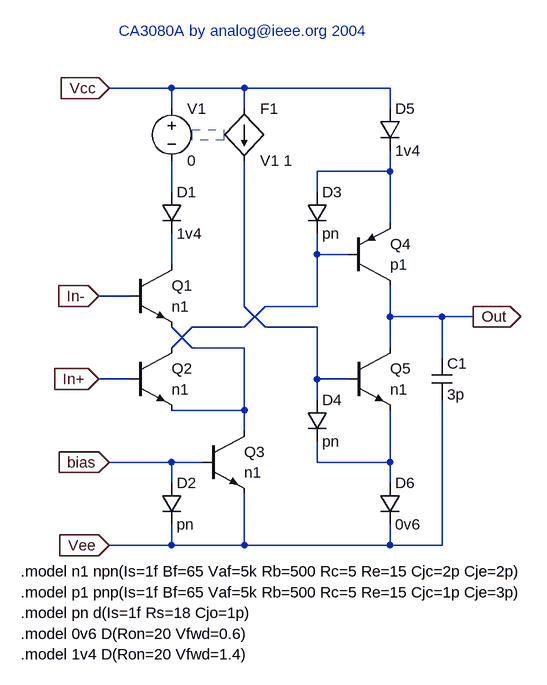
[diagram p0: schematic ca3080a.asc]
ca3080a.asc, the LTspice schematic file:
Version 4
SHEET 1 4648 824
WIRE 1280 512 1232 512
WIRE 1136 640 1232 640
WIRE 1344 640 1344 560
WIRE 1344 464 1344 432
WIRE 1344 336 1344 432
WIRE 1232 -64 1232 -32
WIRE 1232 160 1232 208
WIRE 1232 48 1232 96
WIRE 1344 -64 1344 -32
WIRE 1344 48 1344 272
WIRE 1232 -64 1344 -64
WIRE 1344 -64 1568 -64
WIRE 1568 640 1344 640
WIRE 1568 -64 1568 -32
WIRE 1568 240 1568 288
WIRE 1568 432 1568 512
WIRE 1456 384 1456 416
WIRE 1456 480 1456 512
WIRE 1456 512 1568 512
WIRE 1568 512 1568 544
WIRE 1456 64 1456 96
WIRE 1456 160 1456 192
WIRE 1456 64 1568 64
WIRE 1568 64 1568 144
WIRE 1568 608 1568 640
WIRE 1568 32 1568 64
WIRE 1568 288 1648 288
WIRE 1568 288 1568 336
WIRE 1504 384 1456 384
WIRE 1504 192 1456 192
WIRE 1232 -64 1136 -64
WIRE 1168 256 1120 256
WIRE 1168 384 1120 384
WIRE 1264 304 1232 336
WIRE 1344 272 1376 304
WIRE 1232 304 1264 336
WIRE 1264 336 1344 336
WIRE 1456 384 1456 304
WIRE 1456 304 1376 304
WIRE 1232 640 1232 608
WIRE 1232 544 1232 512
WIRE 1232 512 1136 512
WIRE 1232 640 1344 640
WIRE 1376 272 1344 304
WIRE 1344 304 1264 304
WIRE 1456 192 1456 272
WIRE 1456 272 1376 272
WIRE 1344 432 1232 432
WIRE 1648 288 1648 352
WIRE 1648 416 1648 640
WIRE 1648 288 1696 288
WIRE 1648 640 1568 640
FLAG 1136 -64 Vcc
IOPIN 1136 -64 In
FLAG 1120 384 In+
IOPIN 1120 384 In
FLAG 1120 256 In-
IOPIN 1120 256 In
FLAG 1136 512 bias
IOPIN 1136 512 In
FLAG 1136 640 Vee
IOPIN 1136 640 In
FLAG 1696 288 Out
IOPIN 1696 288 Out
SYMBOL voltage 1232 -48 R0
WINDOW 3 24 96 Left 0
SYMATTR Value 0
SYMATTR InstName V1
SYMBOL f 1344 -32 R0
WINDOW 3 24 80 Left 0
SYMATTR Value V1 1
SYMATTR InstName F1
SYMBOL diode 1216 96 R0
SYMATTR InstName D1
SYMATTR Value 1v4
SYMBOL npn 1168 208 R0
WINDOW 0 64 32 Left 0
WINDOW 3 64 64 Left 0
SYMATTR InstName Q1
SYMATTR Value n1
SYMBOL npn 1168 336 R0
WINDOW 0 64 32 Left 0
WINDOW 3 64 64 Left 0
SYMATTR InstName Q2
SYMATTR Value n1
SYMBOL npn 1280 464 R0
WINDOW 0 64 32 Left 0
WINDOW 3 64 64 Left 0
SYMATTR InstName Q3
SYMATTR Value n1
SYMBOL diode 1216 544 R0
SYMATTR InstName D2
SYMATTR Value pn
SYMBOL diode 1440 96 R0
SYMATTR InstName D3
SYMATTR Value pn
SYMBOL diode 1440 416 R0
SYMATTR InstName D4
SYMATTR Value pn
SYMBOL pnp 1504 240 M180
WINDOW 0 64 64 Left 0
WINDOW 3 64 32 Left 0
SYMATTR InstName Q4
SYMATTR Value p1
SYMBOL npn 1504 336 R0
WINDOW 0 64 32 Left 0
WINDOW 3 64 64 Left 0
SYMATTR InstName Q5
SYMATTR Value n1
SYMBOL diode 1552 -32 R0
SYMATTR InstName D5
SYMATTR Value 1v4
SYMBOL diode 1552 544 R0
SYMATTR InstName D6
SYMATTR Value 0v6
SYMBOL cap 1632 352 R0
WINDOW 3 24 56 Left 0
SYMATTR InstName C1
SYMATTR Value 3p
TEXT 1000 776 Left 0 !.model 0v6 D(Ron=20 Vfwd=0.6)
TEXT 1000 808 Left 0 !.model 1v4 D(Ron=20 Vfwd=1.4)
TEXT 1000 744 Left 0 !.model pn d(Is=1f Rs=18 Cjo=1p)
TEXT 1000 680 Left 0 !.model n1 npn(Is=1f Bf=65 Vaf=5k Rb=500 Rc=5 Re=15 Cjc=2p Cje=2p)
TEXT 1344 -152 Center 0 ;CA3080A by analog@ieee.org 2004
TEXT 1000 712 Left 0 !.model p1 pnp(Is=1f Bf=65 Vaf=5k Rb=500 Rc=5 Re=15 Cjc=1p Cje=3p)
RECTANGLE Normal 1312 16 1264 0 2

The netlist it stands for:
* ca3080a.asc
V1 Vcc N003 0
F1 Vcc N004 V1 1
D1 N003 N002 1v4
Q1 N002 In- N001 0 n1
Q2 N007 In+ N001 0 n1
Q3 N001 bias Vee 0 n1
D2 bias Vee pn
D3 N006 N007 pn
D4 N004 N005 pn
Q4 Out N007 N006 0 p1
Q5 Out N004 N005 0 n1
D5 Vcc N006 1v4
D6 N005 Vee 0v6
C1 Out Vee 3p
.model D D
.lib standard.dio
.model NPN NPN
.model PNP PNP
.lib standard.bjt
.model 0v6 D(Ron=20 Vfwd=0.6)
.model 1v4 D(Ron=20 Vfwd=1.4)
.model pn d(Is=1f Rs=18 Cjo=1p)
.model n1 npn(Is=1f Bf=65 Vaf=5k Rb=500 Rc=5 Re=15 Cjc=2p Cje=2p)
* CA3080A by analog@ieee.org 2004
.model p1 pnp(Is=1f Bf=65 Vaf=5k Rb=500 Rc=5 Re=15 Cjc=1p Cje=3p)
.backanno
.end